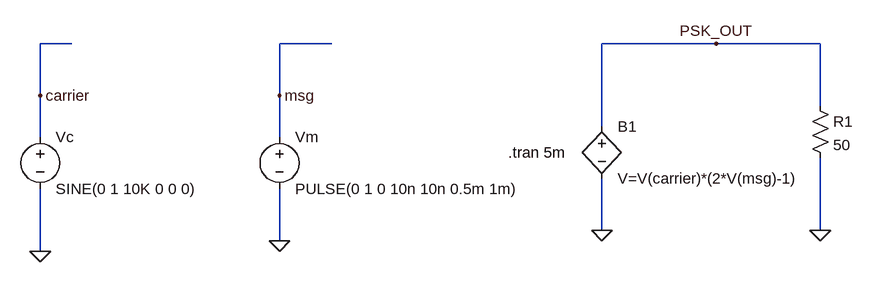
[diagram p0: schematic Q9 Binary Phase Shift Keying (BPSK.asc]
Q9 Binary Phase Shift Keying (BPSK.asc, the LTspice schematic file:
Version 4
SHEET 1 1352 680
WIRE 144 -48 96 -48
WIRE 544 -48 464 -48
WIRE 1136 -48 960 -48
WIRE 1296 -48 1136 -48
WIRE 96 32 96 -48
WIRE 464 32 464 -48
WIRE 1296 48 1296 -48
WIRE 960 80 960 -48
WIRE 96 96 96 32
WIRE 464 96 464 32
WIRE 960 240 960 160
WIRE 1296 240 1296 128
WIRE 464 256 464 176
WIRE 96 272 96 176
FLAG 96 272 0
FLAG 96 32 carrier
FLAG 464 256 0
FLAG 464 32 msg
FLAG 960 240 0
FLAG 1296 240 0
FLAG 1136 -48 PSK_OUT
SYMBOL voltage 96 80 R0
WINDOW 123 0 0 Left 0
WINDOW 39 0 0 Left 0
SYMATTR InstName Vc
SYMATTR Value SINE(0 1 10K 0 0 0)
SYMBOL voltage 464 80 R0
WINDOW 123 0 0 Left 0
WINDOW 39 0 0 Left 0
SYMATTR InstName Vm
SYMATTR Value PULSE(0 1 0 10n 10n 0.5m 1m)
SYMBOL bv 960 64 R0
SYMATTR InstName B1
SYMATTR Value V=V(carrier)*(2*V(msg)-1)
SYMBOL res 1280 32 R0
SYMATTR InstName R1
SYMATTR Value 50
TEXT 816 120 Left 2 !.tran 5m

The netlist it stands for:
* Q9 Binary Phase Shift Keying (BPSK.asc
Vc carrier 0 SINE(0 1 10K 0 0 0)
Vm msg 0 PULSE(0 1 0 10n 10n 0.5m 1m)
B1 PSK_OUT 0 V=V(carrier)*(2*V(msg)-1)
R1 PSK_OUT 0 50
.tran 5m
.backanno
.end